# EAGLE design HomeAutoModule (EAGLE 7.7.0)
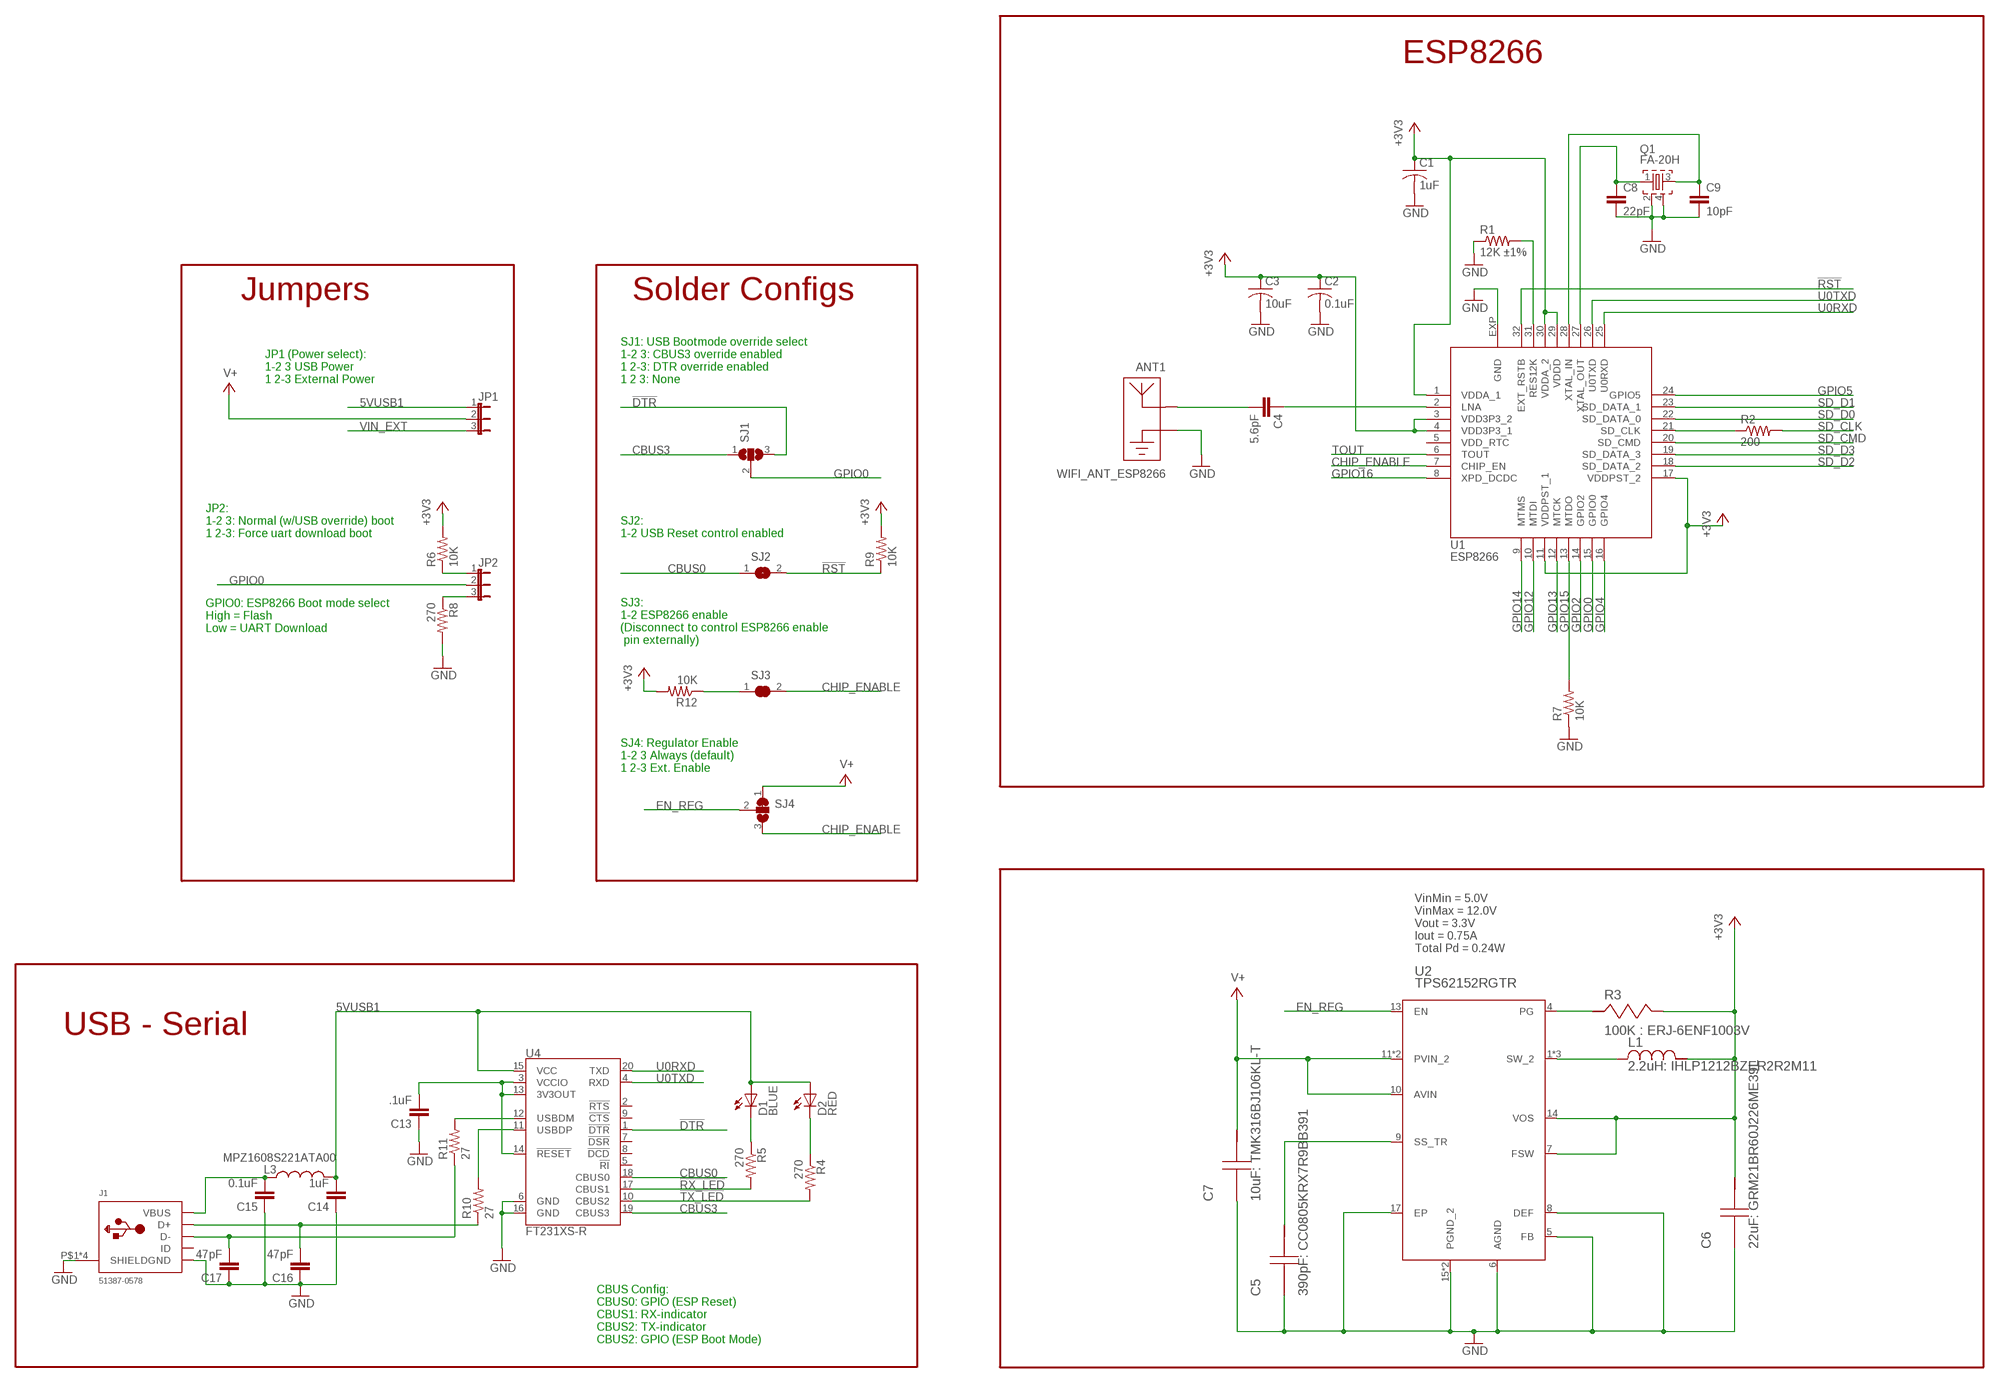
[diagram p0: schematic, sheet 1, part 1 of 2]
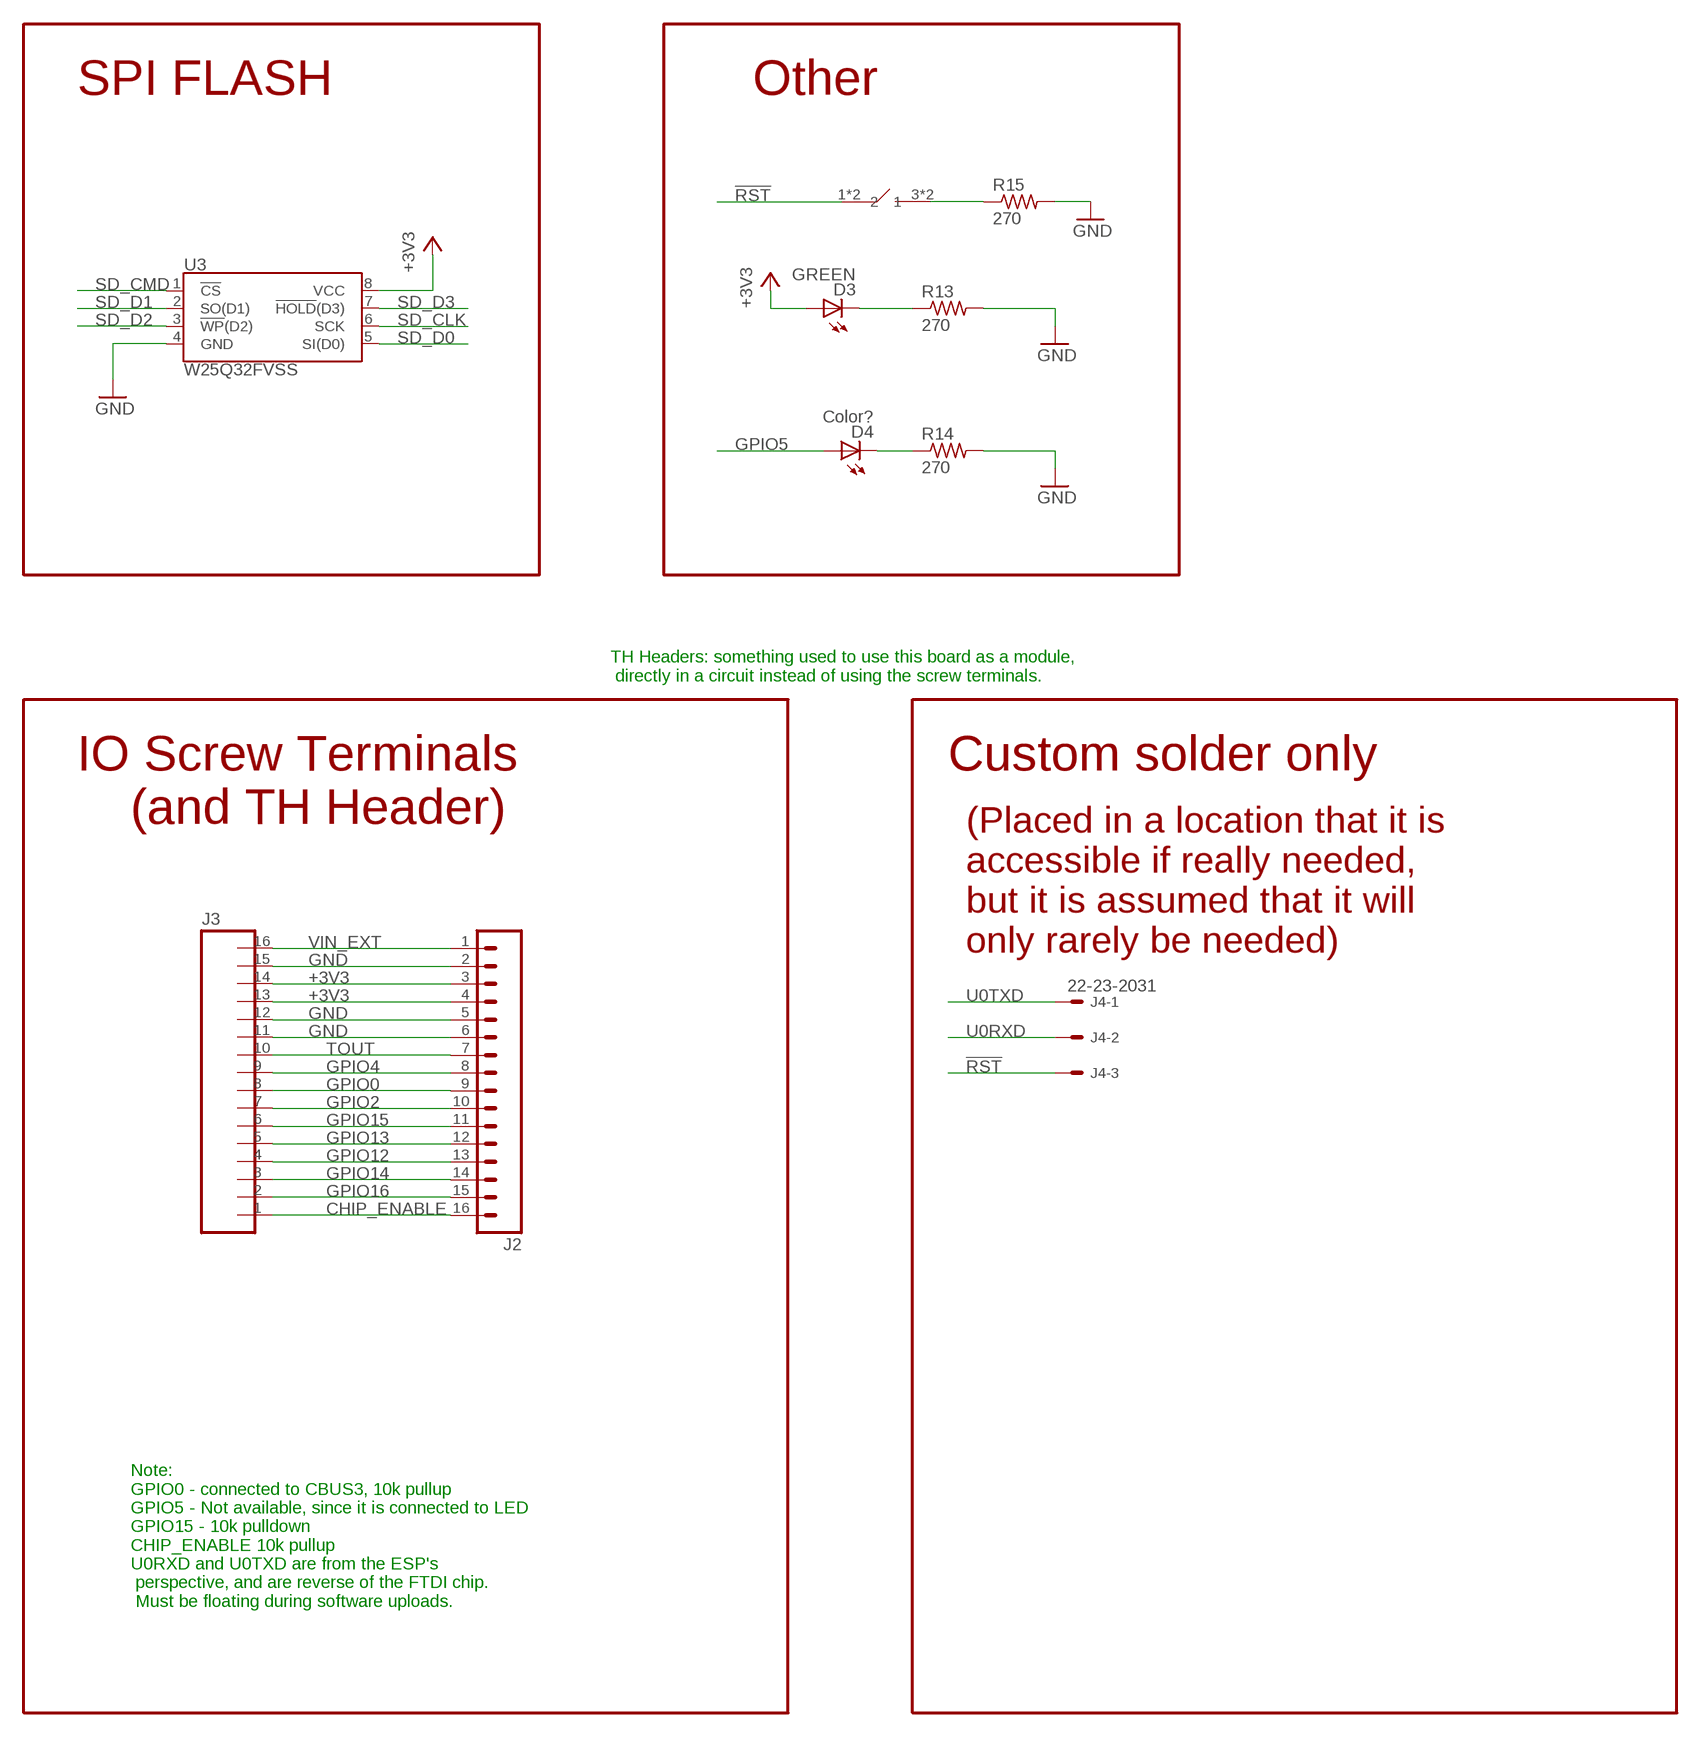
[diagram p1: schematic, sheet 1, part 2 of 2]

## Parts
ANT1  WIFI_ANT_ESP8266  [ESP8266_ANT]
C1  1uF  C-USC0603  [C0603]
C2  0.1uF  C-USC0603K  [C0603K]
C3  10uF  C-USC0805  [C0805]
C4  5.6pF  C-EUC0603  [C0603]
C5  390pF: CC0805KRX7R9BB391  CC0805KRX7R9BB391  [0805]
C6  22uF: GRM21BR60J226ME39L  GRM21BR60J226ME39L  [0805]
C7  10uF: TMK316BJ106KL-T  TMK316BJ106KL-T  [1206]
C8  22pF  C-EUC0603  [C0603]
C9  10pF  C-EUC0603  [C0603]
C13  .1uF  C-EUC0603K  [C0603K]
C14  1uF  C-EUC0603K  [C0603K]
C15  0.1uF  C-EUC0603K  [C0603K]
C16  47pF  C-EUC0603K  [C0603K]
C17  47pF  C-EUC0603K  [C0603K]
D1  BLUE  LEDCHIPLED_0603  [CHIPLED_0603]
D2  RED  LEDCHIPLED_0603  [CHIPLED_0603]
D3  GREEN  LEDCHIPLED_0603  [CHIPLED_0603]
D4  Color?  LEDCHIPLED_0603  [CHIPLED_0603]
J1  51387-0578  USB  [USB-MINIB-0513870578]
J2  M161X16_NO_SILK  [1X16_NO_SILK]
J3  PTSA_250_16  [PTSA_250_16_F]
J4  22-23-2031  [22-23-2031]
JP1  JP2E  [JP2]
JP2  JP2E  [JP2]
L1  2.2uH: IHLP1212BZER2R2M11  IHLP1212BZER2R2M11  [IHLP-1212BZ]
L3  MPZ1608S221ATA00  INDUCTOR0603  [0603]
Q1  FA-20H  [FA-20H]
R1  12K ±1%  R-US_R0603  [R0603]
R2  200  R-US_R0603  [R0603]
R3  100K : ERJ-6ENF1003V  ERJ-6ENF1003V  [0805]
R4  270  R-US_R0603  [R0603]
R5  270  R-US_R0603  [R0603]
R6  10K  R-US_R0603  [R0603]
R7  10K  R-US_R0603  [R0603]
R8  270  R-US_R0603  [R0603]
R9  10K  R-US_R0603  [R0603]
R10  27  R-US_R0603  [R0603]
R11  27  R-US_R0603  [R0603]
R12  10K  R-US_R0603  [R0603]
R13  270  R-US_R0603  [R0603]
R14  270  R-US_R0603  [R0603]
R15  270  R-US_R0603  [R0603]
SJ1  SJ2W  [SJ_2]
SJ2  SJ  [SJ]
SJ3  SJ_C  [SJ_C]
SJ4  SJ2_C  [SJ_2_C]
SW1  PTS645SM43SMTR92DEFAULT  [PTS645SM43SMTR92]
U1  ESP8266  [HVQFN32]
U2  TPS62152RGTR  [S-PVQFN-N16]
U3  W25Q32FVSS  [SOIC-8]
U4  FT231XS-R  FT231XS  [SSOP20_L]

## Nets
5VUSB1: C14.2 D1.A D2.A JP1.1 L3.2 U4.15(VCC)
!DTR: SJ1.3 U4.1(!DTR)
!RST: J4.3 R9.1 SJ2.2 SW1.1 SW1.2 U1.32(EXT_RSTB)
!RX_LED: R5.2 U4.17(CBUS1)
!TX_LED: R4.2 U4.10(CBUS2)
+3V3: C1.1 C2.1 C3.1 C6.1 D3.A J2.3 J2.4 J3.13 J3.14 L1.2 R3.1 R6.2 R9.2 R12.2 U1.1(VDDA_1) U1.3(VDD3P3_2) U1.4(VDD3P3_1) U1.11(VDDPST_1) U1.17(VDDPST_2) U1.29(VDDD) U1.30(VDDA_2) U2.7(FSW) U2.14(VOS) U3.8(VCC)
CBUS0: SJ2.1 U4.18(CBUS0)
CBUS3: SJ1.1 U4.19(CBUS3)
CHIP_ENABLE: J2.16 J3.1 SJ3.2 SJ4.3 U1.7(CHIP_EN)
EN_REG: SJ4.2 U2.13(EN)
ESP_12K: R1.2 U1.31(RES12K)
GND: ANT1.GND C1.2 C2.2 C3.2 C5.2 C6.2 C7.2 C8.2 C9.2 C13.1 C14.1 C15.1 C16.1 C17.1 J1.GND J1.P$1(SHIELD) J1.P$2(SHIELD) J1.P$3(SHIELD) J1.P$4(SHIELD) J2.2 J2.5 J2.6 J3.11 J3.12 J3.15 Q1.2 Q1.4 R1.1 R7.1 R8.2 R13.2 R14.2 R15.2 U1.EXP(GND) U2.5(FB) U2.6(AGND) U2.8(DEF) U2.15(PGND_2) U2.16(PGND_2) U2.17(EP) U3.4(GND) U4.6(GND) U4.16(GND)
GPIO0: J2.9 J3.8 JP2.2 SJ1.2 U1.15(GPIO0)
GPIO2: J2.10 J3.7 U1.14(GPIO2)
GPIO4: J2.8 J3.9 U1.16(GPIO4)
GPIO5: D4.A U1.24(GPIO5)
GPIO12: J2.13 J3.4 U1.10(MTDI)
GPIO13: J2.12 J3.5 U1.12(MTCK)
GPIO14: J2.14 J3.3 U1.9(MTMS)
GPIO15: J2.11 J3.6 R7.2 U1.13(MTDO)
GPIO16: J2.15 J3.2 U1.8(XPD_DCDC)
LNA: C4.1 U1.2(LNA)
N$2: R2.1 U1.21(SD_CLK)
N$4: ANT1.ANT C4.2
N$5: JP2.3 R8.1
N$7: C5.1 U2.9(SS_TR)
N$9: JP2.1 R6.1
N$10: R3.2 U2.4(PG)
N$11: L1.1 U2.1(SW_2) U2.2(SW_2) U2.3(SW_2)
N$14: C13.2 U4.3(VCCIO) U4.13(3V3OUT) U4.14(!RESET)
N$15: D2.C R4.1
N$16: D1.C R5.1
N$17: R11.2 U4.12(USBDM)
N$18: R12.1 SJ3.1
N$19: R10.2 U4.11(USBDP)
N$21: D3.C R13.1
N$25: D4.C R14.1
N$26: R15.1 SW1.3 SW1.4
SD_CLK: R2.2 U3.6(SCK)
SD_CMD: U1.20(SD_CMD) U3.1(!CS!)
SD_D0: U1.22(SD_DATA_0) U3.5(SI(D0))
SD_D1: U1.23(SD_DATA_1) U3.2(SO(D1))
SD_D2: U1.18(SD_DATA_2) U3.3(!WP!(D2))
SD_D3: U1.19(SD_DATA_3) U3.7(!HOLD!(D3))
TOUT: J2.7 J3.10 U1.6(TOUT)
U0RXD: J4.2 U1.25(U0RXD) U4.20(TXD)
U0TXD: J4.1 U1.26(U0TXD) U4.4(RXD)
USB_D+: C16.2 J1.D+ R10.1
USB_D-: C17.2 J1.D- R11.1
USB_VBUS: C15.2 J1.VBUS L3.1
V+: C7.1 JP1.2 SJ4.1 U2.10(AVIN) U2.11(PVIN_2) U2.12(PVIN_2)
VIN_EXT: J2.1 J3.16 JP1.3
XTAL_IN: C9.1 Q1.3 U1.28(XTAL_IN)
XTAL_OUT: C8.1 Q1.1 U1.27(XTAL_OUT)
Unconnected: J1.ID U1.5(VDD_RTC) U4.2(!RTS) U4.5(!RI) U4.7(!DSR) U4.8(!DCD) U4.9(!CTS)

## Notes on the sheet
- ESP8266
- SPI FLASH | Other
- Jumpers | Solder Configs
- JP1 (Power select):
  1-2 3 USB Power
  1 2-3 External Power
- SJ1: USB Bootmode override select
  1-2 3: CBUS3 override enabled
  1 2-3: DTR override enabled
  1 2 3: None
- JP2:
  1-2 3: Normal (w/USB override) boot
  1 2-3: Force uart download boot
- SJ2:
  1-2 USB Reset control enabled
- Todo: External Power
- GPIO0: ESP8266 Boot mode select
  High = Flash
  Low = UART Download
- SJ3:
  1-2 ESP8266 enable 
  (Disconnect to control ESP8266 enable 
   pin externally)
- TH Headers: something used to use this board as a module,
   directly in a circuit instead of using the screw terminals.
- SJ4: Regulator Enable
  1-2 3 Always (default)
  1 2-3 Ext. Enable
- IO Screw Terminals | Custom solder only
- (Placed in a location that it is
  accessible if really needed, 
  but it is assumed that it will 
  only rarely be needed)
- (and TH Header)
- VinMin = 5.0V
  VinMax = 12.0V
  Vout = 3.3V
  Iout = 0.75A
  Total Pd = 0.24W
- USB - Serial
- Note:
  GPIO0 - connected to CBUS3, 10k pullup
  GPIO5 - Not available, since it is connected to LED
  GPIO15 - 10k pulldown
  CHIP_ENABLE 10k pullup
  U0RXD and U0TXD are from the ESP's
   perspective, and are reverse of the FTDI chip.
   Must be floating during software uploads.
- CBUS Config:
  CBUS0: GPIO (ESP Reset)
  CBUS1: RX-indicator
  CBUS2: TX-indicator
  CBUS2: GPIO (ESP Boot Mode)

## Library data of the parts
ANT1 = OLIMEX_ANT:WIFI_ANT_ESP8266
C1-C3 = rcl:C-US: CAPACITOR, American symbol
C4 C8 C9 = rcl:C-EU: CAPACITOR, European symbol
C5 = power:CC0805KRX7R9BB391; CAP: 3.9E-10; ESR: 0.0; IRMS: 0.0; MANUFACTURER_NAME: Yageo America; MANUFACTURER_PART_NUMBER: CC0805KRX7R9BB391; VDC: 50.0; VENDOR: Yageo America
C6 = power:GRM21BR60J226ME39L; CAP: 2.2E-5; ESR: 0.0; IRMS: 0.0; MANUFACTURER_NAME: MuRata; MANUFACTURER_PART_NUMBER: GRM21BR60J226ME39L; VDC: 6.3; VENDOR: MuRata
C7 = power:TMK316BJ106KL-T; CAP: 1.0E-5; ESR: 0.0; IRMS: 0.0; MANUFACTURER_NAME: Taiyo Yuden; MANUFACTURER_PART_NUMBER: TMK316BJ106KL-T; VDC: 25.0; VENDOR: Taiyo Yuden
C13-C17 = resistor:C-EU: CAPACITOR, European symbol
D1-D4 = led:LED: LED OSRAM: - CHIPLED LG R971, LG N971, LY N971, LG Q971, LY Q971, LO R971, LY R971 LH N974, LH R974 LS Q976, LO Q976, LY Q976 LO Q996 - Hyper CHIPLED LW Q18S LB Q993, LB Q99A, LB R99A - SideLED LS A670, LO A670, LY A670, LG A670, LP A670 LB A673, LV A673, LT A673, LW A673 LH A674 LY A675 LS A676, LA A676, LO A676, LY A676, LW A676 LS A679, LY A679, LG A679 - Hyper Micro SIDELED® LS Y876, LA Y876, LO Y876, LY Y876 LT Y87S - SmartLED LW L88C, LW L88S LB L89C, LB L89S, LG L890 LS L89K, LO L89K, LY L89K LS L896, LA L896, LO L896, LY L896 - TOPLED LS T670, LO T670, LY T670, LG T670, LP T670 LSG T670, LSP T670, LSY T670, LOP T670, LYG T670 LG T671, LOG T671, LSG T671 LB T673, LV T673, LT T673, LW T673 LH T674 LS T676, LA T676, LO T676, LY T676, LB T676, LH T676, LSB T676, LW T676 LB T67C, LV T67C, LT T67C, LS T67K, LO T67K, LY T67K, LW E67C LS E67B, LA E67B, LO E67B, LY E67B, LB E67C, LV E67C, LT E67C LW T67C LS T679, LY T679, LG T679 LS T770, LO T770, LY T770, LG T770, LP T770 LB T773, LV T773, LT T773, LW T773 LH T774 LS E675, LA E675, LY E675, LS T675 LS T776, LA T776, LO T776, LY T776, LB T776 LHGB T686 LT T68C, LB T68C - Hyper Mini TOPLED® LB M676 - Mini TOPLED Santana® LG M470 LS M47K, LO M47K, LY M47K Source: http://www.osram.convergy.de LUXEON: - LUMILED® LXK2-PW12-R00, LXK2-PW12-S00, LXK2-PW14-U00, LXK2-PW14-V00 LXK2-PM12-R00, LXK2-PM12-S00, LXK2-PM14-U00 LXK2-PE12-Q00, LXK2-PE12-R00, LXK2-PE12-S00, LXK2-PE14-T00, LXK2-PE14-U00 LXK2-PB12-K00, LXK2-PB12-L00, LXK2-PB12-M00, LXK2-PB14-N00, LXK2-PB14-P00, LXK2-PB14-Q00 LXK2-PR12-L00, LXK2-PR12-M00, LXK2-PR14-Q00, LXK2-PR14-R00 LXK2-PD12-Q00, LXK2-PD12-R00, LXK2-PD12-S00 LXK2-PH12-R00, LXK2-PH12-S00 LXK2-PL12-P00, LXK2-PL12-Q00, LXK2-PL12-R00 Source: www.luxeon.com KINGBRIGHT: KA-3528ASYC Source: www.kingbright.com
J1 = adafruit:USB: USB Connectors USBMINIB - Surface Mount Female Mini-B USB Connector 4UConnector: 06564 By microbuilder.eu Thru-hole RA Female Mini-B USB Connector 4UConnector: 18732 By ladyada.net
J2 = SparkFun-Connectors:M16: 1x16 .1" header
J3 = con-phoenix-250:PTSA_250_16
J4 = con-molex-random-mods-by-me:22-23-2031: .100" (2.54mm) Center Header - 3 Pin; MF: MOLEX; MPN: 22-23-2031; OC_FARNELL: 1462950; OC_NEWARK: 30C0862
JP1 JP2 = jumper:JP2E: JUMPER
L1 = power:IHLP1212BZER2R2M11; DATASHEETURL: http://www.vishay.com/docs/34289/lp12bz11.pdf; DCR: 46.0; DESCRIPTION: Unknown; IDC: 3.0; L: 2.2E-6; MANUFACTURER: Vishay; MANUFACTURER_NAME: Vishay-Dale; MANUFACTURER_PART_NUMBER: IHLP1212BZER2R2M11; PACKAGE_DESIGNATOR: IHLP-1212BZ; VENDOR: Vishay-Dale
L3 = SparkFun-Passives:INDUCTOR: Inductors Basic Inductor/Choke - 0603 and 1206. Footprints are not proven and vary greatly between part numbers. INDUCTOR POWER 3.3UH 4.0A SMD 0.197" L x 0.197" W x 0.177" H (5.00mm x 5.00mm x 4.50mm)
Q1 = crystal:FA-: MHz RANGE CRYSTAL UNIT Source: Epson Toyocom
R1 R2 R6 R7 R9 R12 = rcl:R-US_: RESISTOR, American symbol
R3 = power:ERJ-6ENF1003V; MANUFACTURER_NAME: Panasonic; MANUFACTURER_PART_NUMBER: ERJ-6ENF1003V; POWER: 0.125; RESISTANCE: 100000.0; TOLERANCE: 1.0; VENDOR: Panasonic
R4 R5 R8 R10 R11 R13-R15 = resistor:R-US_: RESISTOR, American symbol
SJ1 = jumper:SJ2W: SMD solder JUMPER
SJ2 = jumper:SJ: SMD solder JUMPER
SJ3 = jumper:SJ_C: SMD solder JUMPER
SJ4 = jumper:SJ2_C: SMD solder JUMPER
SW1 = button:PTS645SM43SMTR92
U1 = esp8266:ESP8266
U2 = power:TPS62152RGTR; DATASHEETURL: http://www.ti.com/product/tps62131; FREQUENCY: 2500000.0; IMAX: 3.0; MANUFACTURER_NAME: Texas Instruments; MANUFACTURER_PART_NUMBER: TPS62131RGTR; MKTG_PACKAGE: S-PVQFN-N16; NSID: TPS62131RGTR; PACKAGE: S-PVQFN-N16; VENDOR: Texas Instruments
U3 = SparkFun-DigitalIC:W25Q32FV: Winbond W25Q32FV 32Mbit (4MB) Flash The W25Q32FV support the standard Serial Peripheral Interface (SPI), Dual/Quad I/O SPI as well as 2-clocks instruction cycle Quad Peripheral Interface (QPI). Datasheet <http://www.winbond.com/resource-files/w25q32fv%20revh%20091613.pdf>; PROD_ID: IC-13229
U4 = SparkFun-DigitalIC:FT231X: FTDI FT231X Full Speed USB to Full-handshake UART This USB2.0 Full Speed IC offers a compact bridge to full handshake UART interfaces. The device is a UART, capable of operating up to 3MBaud, with low power consumption (8mA). The FT231X includes the complete FT-X series feature set and enables USB to be added into a system design quickly and easily over a UART interface.; PROD_ID: IC-11524; VALUE: FTS31XS-U

## Board
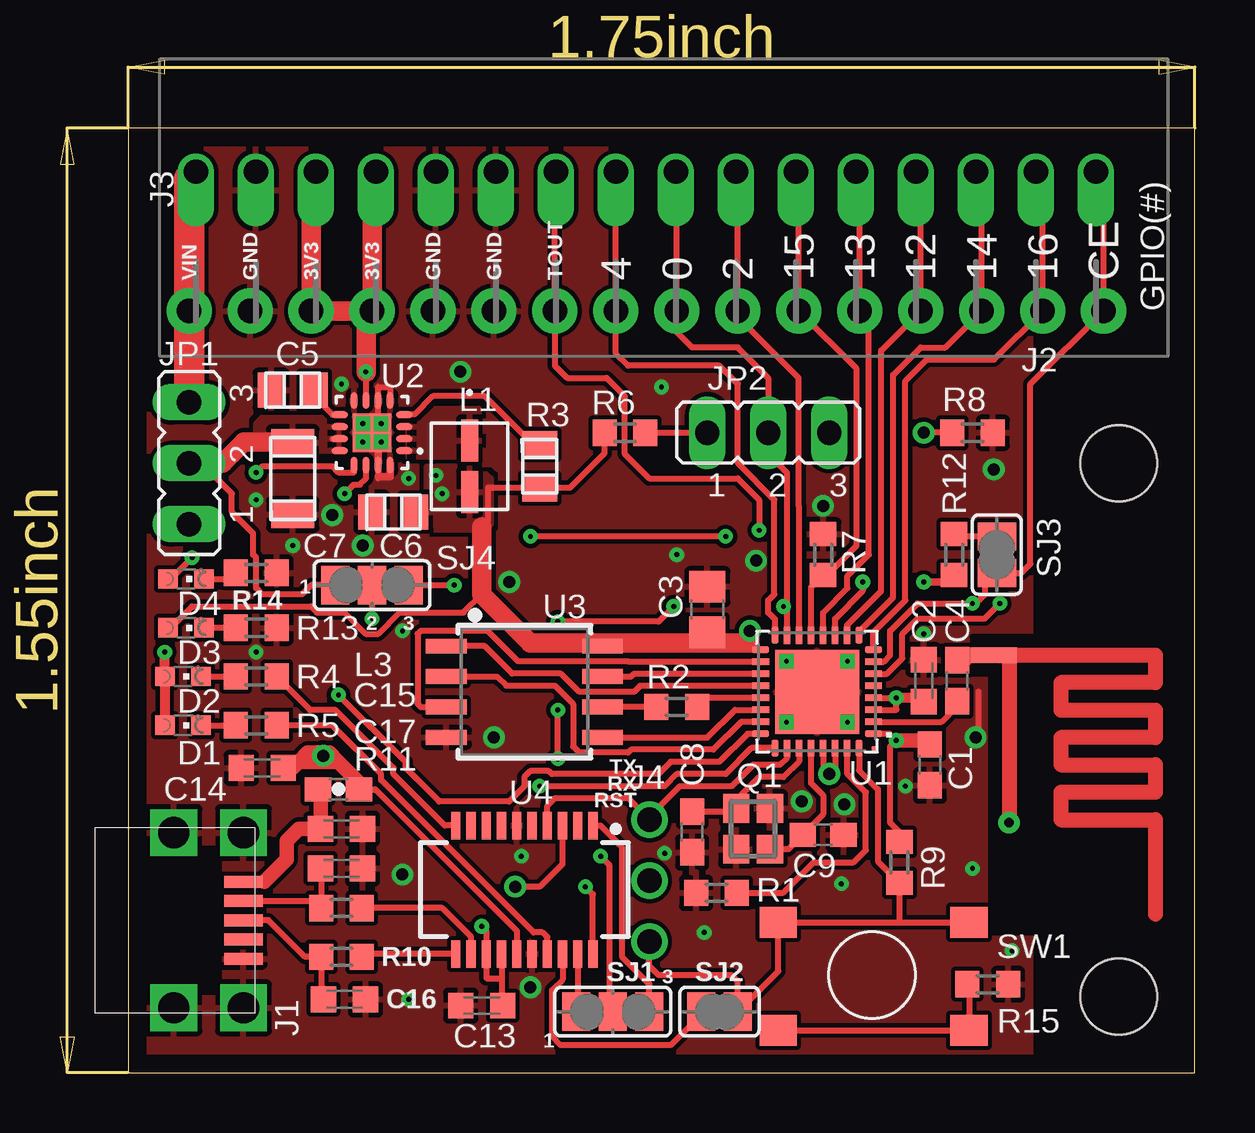
[diagram p2: board, top side]
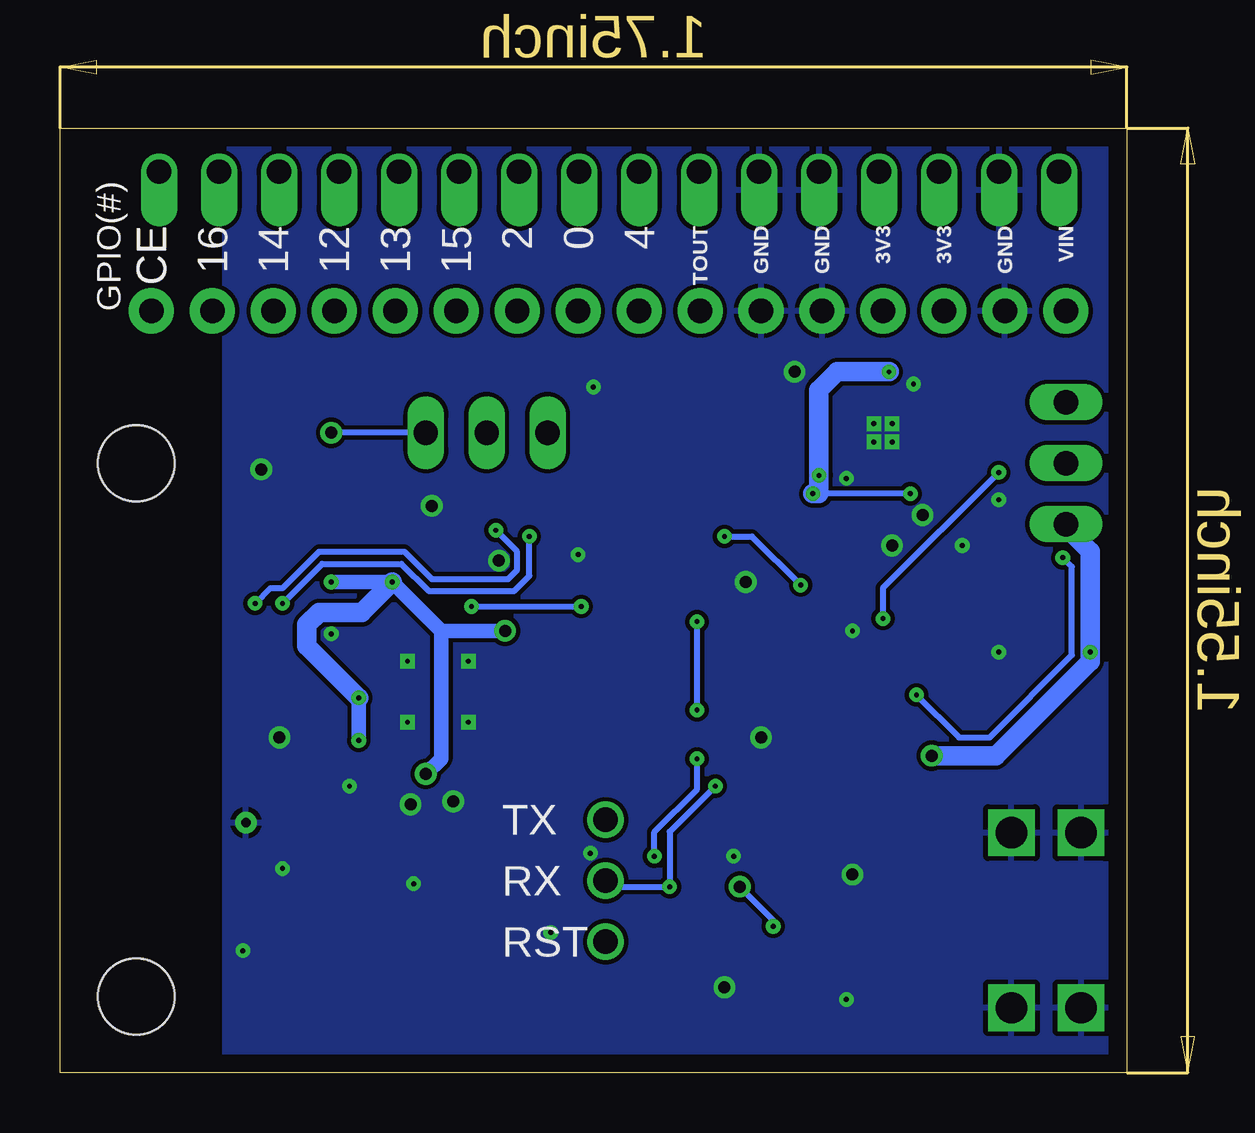
[diagram p3: board, bottom side, seen from below]

Size 44.45 x 39.37 mm. Coordinates in mm from the lower left corner, seen from the top.
Outline: 0,39.37 0,0 44.45,0 44.45,39.37 0,39.37
Copper layers (1*16): Top 0.035mm / dielectric 1.5mm / Bottom 0.035mm
Design rules "Brandon4PCB *": minimum track width 8mil, minimum drill 8mil, track to track 7mil, track to pad 7mil, pad to pad 7mil, via to via 7mil, smd to smd 7mil, copper to edge 30mil, drill to drill 8mil, minimum pad ring 10mil, minimum via ring 8mil, stop-mask expansion 4mil, vias tented up to drill 10mil, thermal gap 8mil
Holes 3.17 mm at 41.27,3.17 41.27,25.4
tRestrict: 5 lines

### Footprints (pad centres in the part's own frame; a part is rotated, then mirrored left to right if it is on the bottom)
ESP8266_ANT = smd 0.635 x 1.905: ANT -5.334,-3.302 | drill 0.4 pad 0.635: GND 1.651,-2.667
C0603 = smd 1.1 x 1: 1 -0.85,0; 2 0.85,0
C0603K = smd 1.05 x 1.08: 1 -0.875,0; 2 0.875,0
C0805 = smd 1.3 x 1.5: 1 -0.95,0; 2 0.95,0
0805 = smd 1.118 x 1.448: 1 -0.902,0; 2 0.902,0
1206 = smd 1.118 x 1.803: 1 -1.499,0; 2 1.499,0
CHIPLED_0603 = smd 0.8 x 0.8: A 0,-0.75; C 0,0.75
USB-MINIB-0513870578 = smd 1.6 x 0.5: D+ 2.9,0; D- 2.9,0.8; GND 2.9,-1.6; ID 2.9,-0.8; VBUS 2.9,1.6 | drill 1.3 square: P$1 2.9,3.65; P$2 0,3.65; P$3 2.9,-3.65; P$4 0,-3.65
1X16_NO_SILK = drill 1.016 pad 1.88: 1 0,0; 2 2.54,0; 3 5.08,0; 4 7.62,0; 5 10.16,0; 6 12.7,0; 7 15.24,0; 8 17.78,0; 9 20.32,0; 10 22.86,0; 11 25.4,0; 12 27.94,0; 13 30.48,0; 14 33.02,0; 15 35.56,0; 16 38.1,0
PTSA_250_16_F = drill 1.016 offset: 1 -2.5,20; 2 -2.5,17.5; 3 -2.5,15; 4 -2.5,12.5; 5 -2.5,10; 6 -2.5,7.5; 7 -2.5,5; 8 -2.5,2.5; 9 -2.5,0; 10 -2.5,-2.5; 11 -2.5,-5; 12 -2.5,-7.5; 13 -2.5,-10; 14 -2.5,-12.5; 15 -2.5,-15; 16 -2.5,-17.5
22-23-2031 = drill 1.016: 1 -2.54,0; 2 0,0; 3 2.54,0
JP2 = drill 1.016 long: 1 -2.54,0; 2 0,0; 3 2.54,0
IHLP-1212BZ = smd 1.753 x 0.711: 1 -1.079,0; 2 1.079,0
0603 = smd 1.1 x 1: 1 -0.85,0; 2 0.85,0
FA-20H = smd 1.2 x 1.1: 1 -0.85,-0.7; 2 0.85,-0.7; 3 0.85,0.7; 4 -0.85,0.7
R0603 = smd 1 x 1.1: 1 -0.85,0; 2 0.85,0
SJ_2 = smd 1.168 x 1.6: 1 -1.524,0; 2 0,0; 3 1.524,0
SJ = smd 1.168 x 1.6: 1 -0.762,0; 2 0.762,0
SJ_C = smd 1.168 x 1.6: 1 -0.762,0; 2 0.762,0
SJ_2_C = smd 1.168 x 1.6: 1 -1.524,0; 2 0,0; 3 1.524,0
PTS645SM43SMTR92 = smd 1.55 x 1.3: 1 -3.9,2.2; 2 4.05,2.2; 3 -3.9,-2.3; 4 4.05,-2.3
HVQFN32 = smd 0.7 x 0.28: 1 -2.35,1.75; 2 -2.35,1.25; 3 -2.35,0.75; 4 -2.35,0.25; 5 -2.35,-0.25; 6 -2.35,-0.75; 7 -2.35,-1.25; 8 -2.35,-1.75; 17 2.35,-1.75; 18 2.35,-1.25; 19 2.35,-0.75; 20 2.35,-0.25; 21 2.35,0.25; 22 2.35,0.75; 23 2.35,1.25; 24 2.35,1.75 | smd 0.28 x 0.7: 9 -1.75,-2.35; 10 -1.25,-2.35; 11 -0.75,-2.35; 12 -0.25,-2.35; 13 0.25,-2.35; 14 0.75,-2.35; 15 1.25,-2.35; 16 1.75,-2.35; 25 1.75,2.35; 26 1.25,2.35; 27 0.75,2.35; 28 0.25,2.35; 29 -0.25,2.35; 30 -0.75,2.35; 31 -1.25,2.35; 32 -1.75,2.35 | smd 3.5 x 3.5: EXP 0,0 | smd 0.25 x 0.25: M1 -2.415,2.415
S-PVQFN-N16 = smd 0.7 x 0.3: 1 -1.35,0.75; 2 -1.35,0.25; 3 -1.35,-0.25; 4 -1.35,-0.75; 9 1.35,-0.75; 10 1.35,-0.25; 11 1.35,0.25; 12 1.35,0.75 | smd 0.3 x 0.7: 5 -0.75,-1.35; 6 -0.25,-1.35; 7 0.25,-1.35; 8 0.75,-1.35; 13 0.75,1.35; 14 0.25,1.35; 15 -0.25,1.35; 16 -0.75,1.35 | smd 1.6 x 1.6: 17 0,0
SOIC-8 = smd 0.61 x 1.702: 1 -1.905,-3.251; 2 -0.635,-3.251; 3 0.635,-3.251; 4 1.905,-3.251; 5 1.905,3.251; 6 0.635,3.251; 7 -0.635,3.251; 8 -1.905,3.251
SSOP20_L = smd 0.381 x 1.143: 1 -2.857,-2.68; 2 -2.223,-2.68; 3 -1.587,-2.68; 4 -0.953,-2.68; 5 -0.318,-2.68; 6 0.318,-2.68; 7 0.953,-2.68; 8 1.587,-2.68; 9 2.223,-2.68; 10 2.857,-2.68; 11 2.857,2.68; 12 2.223,2.68; 13 1.587,2.68; 14 0.953,2.68; 15 0.318,2.68; 16 -0.318,2.68; 17 -0.953,2.68; 18 -1.587,2.68; 19 -2.223,2.68; 20 -2.857,2.68

### Placement (x,y rotation side)
ANT1  39.37,12.06 270 top
C1  33.4,12.83 270 top
C2  33.15,16.33 90 top
C3  24.13,19.3 90 top
C4  34.54,16.33 90 top
C5  6.86,28.45 180 top
C6  11.05,23.37 180 top
C7  6.86,24.77 270 top
C8  23.5,10.03 270 top
C9  28.96,9.91 0 top
C13  14.73,2.79 0 top
C14  5.59,12.7 0 top
C15  8.89,10.16 180 top
C16  9.02,3.05 180 top
C17  8.89,8.51 180 top
D1  2.29,14.48 270 top
D2  2.29,16.51 270 top
D3  2.41,18.54 270 top
D4  2.41,20.57 270 top
DRILEGEND  [DRILEGEND]  0.01,-7.05 0 top  (outside the outline)
J1  1.91,6.35 0 top
J2  2.54,31.75 0 top
J3  20.32,35.05 270 top
J4  21.72,8 270 top
JP1  2.54,25.4 90 top
JP2  26.67,26.67 0 top
L1  14.22,25.27 270 top
L3  8.76,11.81 0 top
Q1  26.04,10.16 270 top
R1  24.51,7.49 0 top
R2  22.86,15.24 180 top
R3  17.14,25.27 90 top
R4  5.33,16.51 0 top
R5  5.33,14.48 0 top
R6  20.7,26.67 180 top
R7  28.96,21.59 270 top
R8  35.18,26.67 0 top
R9  32.13,8.76 90 top
R10  8.89,4.83 0 top
R11  8.89,6.86 0 top
R12  34.42,21.59 270 top
R13  5.33,18.54 0 top
R14  5.33,20.83 0 top
R15  35.81,3.68 0 top
SJ1  20.19,2.54 0 top
SJ2  24.64,2.54 0 top
SJ3  36.2,21.59 270 top
SJ4  10.16,20.32 0 top
SW1  30.99,4.06 0 top
U1  28.7,15.88 180 top
U2  10.16,26.67 180 top
U3  16.51,15.88 270 top
U4  16.51,7.62 180 top

### Tracks (layer width: path | path; a pad name or v marks a point on that pad's centre or on a via)
5VUSB1  (via drill 0.2, 0.5)
  Top 0.254: L3.2 10.29,11.81 16.19,5.91 U4.15
  Top 0.406: D2.A 1.52,16.5 | 1.52,16.5 1.52,14.47 D1.A | 1.52,16.5 v1.52,17.53
  Top 0.61: C14.2 6.86,12.7 7.11,12.95 | 7.11,12.95 7.49,13.34 8,13.34 | 7.11,12.95 8.76,12.95 | 8.76,12.95 9.61,12.1 L3.2 | 8.76,12.95 8.38,13.34 8,13.34 | 8,13.34 v8.13,13.21
  Bottom 0.813: JP1.1 2.54,22.73 1.52,21.72 v1.52,17.53 1.52,17.14 5.46,13.21 v8.13,13.21
!DTR
  Top 0.254: SJ1.3 21.72,3.68 20.57,4.83 20.57,9.4 19.67,10.3 U4.1
!RST
  Top 0.254: 25.65,2.29 SJ2.2 | SJ2.2 27.09,4.23 SW1.1 32.13,6.26 | 32.13,6.26 SW1.2 | SJ2.2 25.4,3.81 25.15,4.06 22.1,4.06 21.72,4.45 J4.3 | U1.32 30.45,12.6 31.24,11.81 31.24,8.8 R9.1 32.13,6.26
!RX_LED
  Top 0.254: U4.17 17.46,5.65 17.27,5.84 16.89,5.84 10.54,12.19 10.54,12.45 8.51,14.48 R5.2
!TX_LED
  Top 0.254: U4.10 13.2,10.3 11.05,12.45 11.05,12.7 8.64,15.11 7.58,15.11 R4.2
+3V3  (via drill 0.2, 0.5)
  Top 0.254: U1.1 31.72,14.12 v32,13.84 31.75,13.59 31.75,10.41 32.13,10.03 R9.2 | U1.4 v32,15.62 32,15.12 U1.3 | U3.8 20.32,17.78 20.32,17.91 | v30.61,20.45 30.61,20.07 29.45,18.91 U1.11 | D3.A 1.78,18.54 2.67,19.43 7.62,19.43 7.87,19.18 9.02,19.18 9.91,18.29 10.41,18.29 11.3,19.18 13.97,19.18 14.73,19.94 | U1.17 25.81,17.62 25.53,17.91 25.4,17.91 | 25.91,17.91 25.69,17.91 | C3.1 24.13,17.91 | U1.29 28.95,12.7 v29.21,12.45 29.45,12.69 U1.30 | U2.7 v9.91,29.21 | 14.73,22.73 14.99,22.99 14.99,24.38 15,24.37 R3.1 17.16,24.38 18.41,24.38 19.85,25.82 R6.2 | 33.49,13.84 33.49,13.77 C1.1 | U2.14 9.91,24.77 9.66,24.51 9.4,24.51 v9.02,24.13
  Top 0.305: R12.2 34.12,20.45 v33.15,20.45
  Top 0.406: C2.1 32.98,15.62 v32,15.62
  Top 0.61: 33.49,13.84 v32,13.84
  Top 0.813: 14.73,22.73 14.73,19.94 16.76,17.91 20.32,17.91 24.13,17.91 25.4,17.91 25.91,17.91 v25.91,18.41 | v9.91,29.21 9.91,31.5 J2.4 | J2.4 J2.3 7.62,37.35 J3.14 | J2.4 10.16,37.39 J3.13
  Bottom 0.254: v9.02,24.13 v13.08,24.13
  Bottom 0.406: 32,20.45 v33.15,20.45
  Bottom 0.61: v33.15,20.45 v30.61,20.45 28.57,18.41 | v25.91,18.41 28.57,18.41 | 28.57,18.41 28.57,13.08 v29.21,12.45 | v32,15.62 v32,13.84
  Bottom 0.813: v32,15.62 34.16,17.78 34.16,18.67 33.66,19.18 31.88,19.18 v30.61,20.45 | v9.91,29.21 12.06,29.21 12.83,28.45 v12.83,24.89 12.83,24.13 v13.08,24.13
  pour Top (rank 2): 12.45,25.27 14.61,25.27 15.11,24.77 15.11,22.86 14.86,22.61 12.45,22.61
CBUS0
  Top 0.254: U4.18 18.1,3.87 17.65,3.43 17.65,1.52 18.03,1.14 22.61,1.14 23.88,2.41 SJ2.1
CBUS3
  Top 0.254: U4.19 18.73,2.6 SJ1.1
CHIP_ENABLE  (via drill 0.2)
  Top 0.254: v24.89,22.35 v16.76,22.35 | U1.7 31.48,17.12 31.75,17.4 31.75,18.41 32.89,19.56 v35.18,19.56 35.31,19.56 35.69,19.94 35.69,20.32 SJ3.2 37.21,20.83 37.59,21.21 37.59,28.7 J2.16 40.64,37.23 J3.1 | SJ4.3 v13.59,20.32
  Bottom 0.254: v24.89,22.35 24.89,20.7 25.53,20.07 29.08,20.07 30.23,21.21 33.53,21.21 v35.18,19.56 | v16.76,22.35 15.62,22.35 v13.59,20.32
EN_REG  (via drill 0.2)
  Top 0.254: 8.89,20.32 SJ4.2 v10.16,18.92 | v5.33,25.02 5.59,25.27 8.51,25.27 8.76,25.02 9.41,25.02 U2.13
  Bottom 0.254: v5.33,25.02 10.16,20.19 v10.16,18.92
ESP_12K
  Top 0.254: R1.2 27.3,7.49 28.57,8.76 30.23,8.76 30.73,9.27 30.73,11.68 29.97,12.45 29.97,13.51 U1.31
GND  (via drill 0.2, 0.5)
  Top 0.254: 10.41,27.3 10.16,27.05 U2.17 10.16,26.16 10.41,26.16 | 10.41,27.3 10.41,28.57 10.91,28.57 U2.5 | v35.31,13.97 35.43,14.1 35.43,15.88 | 10.41,27.18 10.41,27.3 | U2.15 10.41,24.84 10.41,24.77 | U2.15 | 10.41,25.42 10.41,25.4 U2.15
  Top 0.305: 10.92,25.4 10.92,24.84 10.41,24.84 | 10.41,25.42 10.41,26.16
  Top 0.406: v27.43,14.61 U1.EXP
  other vias: 27.43,17.14 28.07,11.3 11.43,8.26 16.38,9.02 11.68,3.05 15.24,13.97 16.76,3.56 29.72,7.87 32.38,11.94 36.83,5.08 35.18,8.51 24,5.84 28.96,23.62 26.16,21.34 22.86,21.59 5.33,17.53 15.88,20.45 29.97,17.14 29.97,14.61 33.15,18.29 29.84,11.18 9.78,21.97 5.33,23.88 6.86,21.97 8.51,23.24 8.89,28.7 11.43,18.41 9.78,26.29 9.78,27.05 10.54,27.05 10.54,26.29 22.35,9.14 13.84,29.21 36.07,25.15 11.68,24.77 22.23,28.57
  pour Top (rank 3): 0,39.37 37.59,39.37 37.59,0 0,0
  pour Bottom (rank 3): 0,39.37 37.59,39.37 37.59,0 0,0
GPIO0  (via drill 0.2 pad 0.41)
  Top 0.254: SJ1.2 20.07,2.67 20.07,8.64 v19.68,9.02 | U1.15 27.45,19.43 | 27.45,19.43 27.45,25 26.67,25.78 JP2.2 26.67,28.96 25.4,30.23 23.5,30.23 22.86,30.86 J2.9 22.86,37.51 J3.8 | v27.3,19.43 27.45,19.43 | v22.73,19.43 22.1,18.8 v17.91,18.8 | v17.91,13.08 v17.91,15.11
  Bottom 0.254: v27.3,19.43 v22.73,19.43 | v19.68,9.02 19.68,10.03 17.91,11.81 v17.91,13.08 | v17.91,15.11 v17.91,18.8
GPIO2
  Top 0.254: U1.14 27.95,23.61 27.94,23.62 27.94,28.96 25.4,31.5 J2.10 25.4,37.47 J3.7
GPIO4
  Top 0.254: U1.16 26.95,18.89 26.67,19.18 26.67,19.68 26.92,19.94 26.92,23.88 25.4,25.4 25.4,28.7 24.64,29.46 20.83,29.46 20.32,29.97 J2.8 J3.9
GPIO5  (via drill 0.2)
  Top 0.254: U1.24 25.81,14.12 24.64,12.95 22.61,12.95 22.1,12.45 17.65,12.45 17.53,12.57 16.76,12.57 16.51,12.32 16.51,11.94 15.88,11.3 12.95,11.3 11.56,12.7 11.56,12.95 v8.76,15.75 | D4.A 1.78,20.57 v2.67,21.46
  Bottom 0.254: v8.76,15.75 6.99,13.97 5.71,13.97 2.29,17.4 2.29,21.08 v2.67,21.46
GPIO12
  Top 0.254: U1.10 29.95,18.65 31.37,20.07 31.37,30.1 J2.13 33.02,37.35 J3.4
GPIO13
  Top 0.254: U1.12 28.95,19.17 29.97,20.19 29.97,20.7 30.86,21.59 30.86,31.37 J2.12 30.48,37.39 J3.5
GPIO14
  Top 0.254: U1.9 30.45,18.39 31.88,19.81 31.88,29.08 33.02,30.23 34.04,30.23 J2.14 35.56,37.31 J3.3
GPIO15
  Top 0.254: U1.13 28.45,20.24 R7.2 29.12,20.74 30.35,21.97 30.35,29.34 J2.11 27.94,37.43 J3.6
GPIO16
  Top 0.254: U1.8 31.05,18.35 32.38,19.68 32.38,28.83 33.27,29.72 36.07,29.72 J2.15 38.1,37.27 J3.2
LNA
  Top 0.254: U1.2 33.89,14.62 34.54,15.28 C4.1
N$2
  Top 0.254: U1.21 24.09,15.62 R2.1
N$4
  Top 0.254: 34.8,17.14 34.76,17.18 C4.2
  Top 0.635: ANT1.ANT 35.05,17.4 34.8,17.14
N$5  (via drill 0.5)
  Top 0.254: R8.1 v33.15,26.67
  Bottom 0.254: JP2.3 v33.15,26.67
N$7
  Top 0.254: U2.9 8.52,27.42 7.76,28.18 C5.1
N$9
  Top 0.254: R6.1 JP2.1
N$10
  Top 0.254: R3.2 16.88,26.18 14.86,28.19 12.7,28.19 11.94,27.43 11.52,27.43 U2.4
N$11
  pour Top: 11.68,27.05 12.19,27.05 12.83,27.69 14.61,27.69 14.61,25.65 11.68,25.65
N$14  (via drill 0.2, 0.5)
  Top 0.254: U4.14 15.56,3.94 | 15.56,3.94 15.56,2.84 C13.2 | 15.56,3.94 14.92,3.94 U4.13 14.92,5.91 v14.73,6.1 | U4.3 18.1,8.7 17.14,7.75 v16.13,7.75
  Bottom 0.254: v14.73,6.1 14.73,6.35 v16.13,7.75
N$15
  Top 0.254: D2.C R4.1
N$16
  Top 0.254: D1.C R5.1
N$17
  Top 0.254: U4.12 14.29,5.65 13.08,6.86 R11.2
N$18
  Top 0.254: SJ3.1 34.51,22.35 R12.1
N$19
  Top 0.254: U4.11 9.74,4.94 R10.2
N$21
  Top 0.254: R13.1 D3.C
N$25
  Top 0.254: D4.C 4.23,20.57 R14.1
N$26
  Top 0.254: SW1.3 SW1.4 35.04,3.61 R15.1
SD_CLK
  Top 0.254: R2.2 U3.6
SD_CMD
  Top 0.254: U3.1 14.86,17.78 16,16.64 18.03,16.64 18.8,15.88 21.08,15.88 21.33,16.12 U1.20
SD_D0
  Top 0.254: U3.5 24.13,13.97 25.29,15.12 U1.22
SD_D1
  Top 0.254: U1.23 25.55,14.62 24.38,13.46 20.95,13.46 20.83,13.34 18.8,13.34 18.54,13.59 18.54,15.37 17.78,16.13 15.75,16.13 15.37,16.51 U3.2
SD_D2
  Top 0.254: U3.3 12.19,15.24 12.06,15.37 12.06,18.29 12.19,18.41 14.99,18.41 16.26,17.14 20.83,17.14 20.85,17.12 U1.18
SD_D3
  Top 0.254: U3.7 20.95,16.51 21.07,16.62 U1.19
TOUT  (via drill 0.2)
  Top 0.254: U1.6 31.61,16.62 32.26,17.27 32.26,18.29 32.89,18.92 35.69,18.92 v36.32,19.56 | J3.10 17.78,37.51 J2.7 17.78,29.46 18.29,28.96 19.94,28.96 20.7,28.19 20.7,25.78 21.72,24.77 25.4,24.77 26.29,23.88 v26.29,22.61
  Bottom 0.254: v26.29,22.61 25.4,21.72 25.4,20.95 25.78,20.57 28.96,20.57 30.1,21.72 33.66,21.72 35.18,20.19 35.69,20.19 v36.32,19.56
U0RXD  (via drill 0.2)
  Top 0.254: U1.25 25.97,13.53 24.89,12.45 22.86,12.45 22.35,11.94 v17.14,11.94 | U4.20 19.37,7.43 v19.05,7.75
  Bottom 0.254: v17.14,11.94 19.05,10.03 v19.05,7.75 21.46,7.75 J4.2
U0TXD
  Top 0.254: U1.26 27.45,13.13 27.15,12.83 26.04,12.83 25.15,11.94 22.99,11.94 21.72,10.67 J4.1 20.83,11.43 17.78,11.43 17.46,11.11 U4.4
USB_D+
  Top 0.254: J1.D+ 5.84,6.35 7.37,4.83 R10.1 8.04,3.53 8.14,3.53 C16.2
USB_D-
  Top 0.254: J1.D- 7.75,7.15 R11.1 8.04,8.51 C17.2
USB_VBUS
  Top 0.508: J1.VBUS 5.66,7.95
  Top 0.61: 5.66,7.95 6.6,8.89 6.6,9.65 7.11,10.16 C15.2 8.02,11.71 L3.1
V+
  Top 0.254: SJ4.1 7.62,20.32 7.24,19.94 5.59,19.94 5.33,20.19 5.33,21.46 5.21,21.59 5.21,22.48 4.32,23.37 4.32,24.13 3.05,25.4 | U2.11 8.76,26.42 | 8.76,26.42 8.64,26.42 8.51,26.42 | 8.78,26.42 8.76,26.42
  Top 0.813: JP1.2 3.05,25.4 3.94,25.4 4.83,26.29 6.83,26.29 C7.1
  pour Top: 5.59,27.3 8.76,27.3 8.76,25.91 6.22,25.91 5.71,26.42 5.33,26.42 5.33,27.05
VIN_EXT
  Top 1.27: JP1.3 J2.1 2.54,37.27 J3.16
XTAL_IN
  Top 0.254: 26.89,9.16 Q1.3 27.51,9.31 C9.1 28.96,10.76 28.96,11.56 28.45,12.06 U1.28
XTAL_OUT
  Top 0.254: U1.27 27.95,12.97 27.3,12.32 26.29,12.32 25.4,11.43 25.4,11.07 Q1.1 25.21,10.88 C8.1

### Text on the board
Dimension: Material: FR4 / Thickness: 0.062" / Copper: 1oz Top & Bottom / Soldermask: Green Top & Bottom / Finish: Lead Free / Silkscreen: White Top & Bottom
tNames: VIN | GND | 3V3 | 3V3 | GND | GND | TOUT | 4 | 0 | 2 | 15 | 13 | 12 | 14 | 16 | CE | GPIO(#) | 1 | 2 | 3 | TX / RX / RST | 3 | 1
bNames: VIN | GND | 3V3 | 3V3 | GND | GND | TOUT | 4 | 0 | 2 | 15 | 13 | 12 | 14 | 16 | CE | GPIO(#) | TX / RX / RST
DrillLegend: LAYER-STACK
DrillLegend_01-16: 01-16
DrillLegend_01-20: 01-20